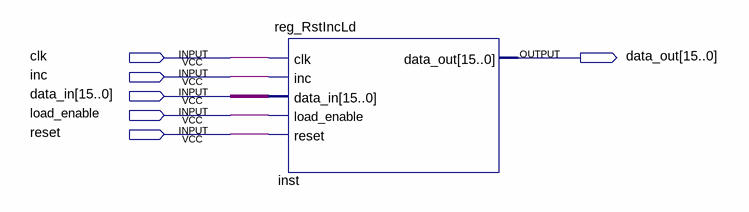
[diagram p0: schematic sheet]
// Quartus schematic check_reg.bdf as structural Verilog: 1 symbols, 6 pins
module check_reg (
  input  clk,
  input  inc,
  input  [15:0] data_in,
  input  load_enable,
  input  reset,
  output [15:0] data_out
);

  reg_RstIncLd inst (
    .clk(clk), .inc(inc), .data_in(data_in), .load_enable(load_enable), .reset(reset), .data_out(data_out));
endmodule
